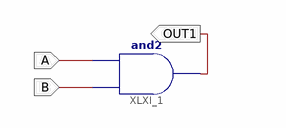
[diagram p0: schematic sheet 1]
// Xilinx ISE schematic AND_2.sch (spartan6) as structural Verilog: 1 symbols, 3 ports
module AND_2 (
  input  A,
  input  B,
  output OUT1
);

  and XLXI_1 (OUT1, B, A);
endmodule
